# Altium schematic sheet PWR.SchDoc: {Наименование}
size 420 x 297 mm; DocumentNumber: ПЛАС.ХХХХХХ.ХХХ ХХ; SheetNumber: {}; SheetTotal: {}; PageSetup: Record=PageOptions|CenterHorizontal=False|CenterVertical=False|PrintScale=0.95|XCorrection=0.00|YCorrection=0.00|PrintKind=1|BorderSize=5000000|LeftOffset=0|BottomOffset=0|Orientation=1|PaperLength=1000|PaperWidth=1000|Scale=100|PaperSource=15|PrintQuality=600|MediaType=1|DitherType=10|PaperKind=A4|PrintScaleMode=1; Rule: PcbType=ProtelPcb
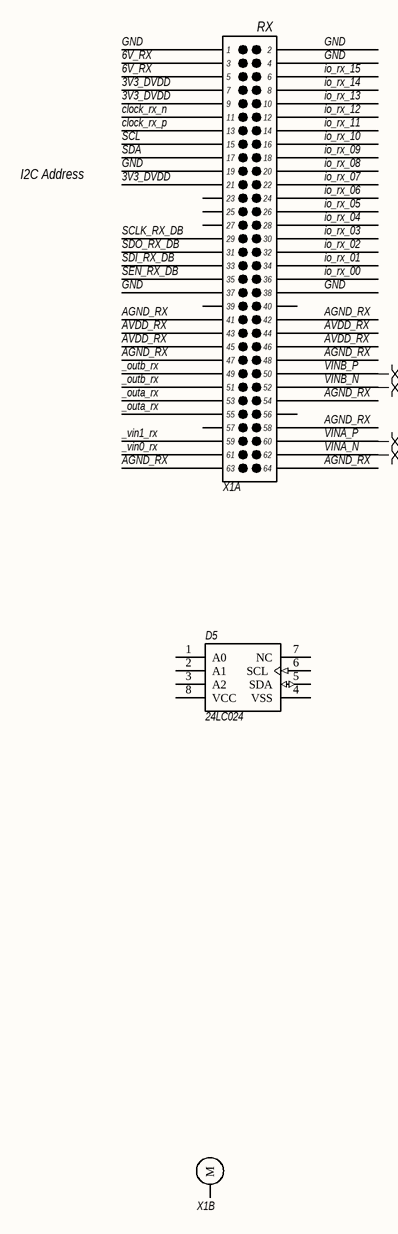
[diagram p0: PWR.SchDoc]

## Parts
D5  24LC024  [SOIC_SN8]
X1  DBoard  [DBoard]  (value not drawn)  (parts A,B of 2)

## Nets
3V3_DVDD: X1.71(7) X1.73(9) X1.85(21)
6V_RX: X1.67(3) X1.69(5)
_outa_rx: X1.117(53) X1.119(55)
_outb_rx: X1.113(49) X1.115(51)
_vin0_rx: X1.125(61)
_vin1_rx: X1.123(59)
AGND_RX: X1.105(41) X1.106(42) X1.111(47) X1.112(48) X1.118(54) X1.122(58) X1.127(63) X1.128(64)
AVDD_RX: X1.107(43) X1.108(44) X1.109(45) X1.110(46)
clock_rx_n: X1.75(11)
clock_rx_p: X1.77(13)
GND: X1.65(1) X1.66(2) X1.68(4) X1.83(19) X1.101(37) X1.102(38)
io_rx_00: X1.100(36)
io_rx_01: X1.98(34)
io_rx_02: X1.96(32)
io_rx_03: X1.94(30)
io_rx_04: X1.92(28)
io_rx_05: X1.90(26)
io_rx_06: X1.88(24)
io_rx_07: X1.86(22)
io_rx_08: X1.84(20)
io_rx_09: X1.82(18)
io_rx_10: X1.80(16)
io_rx_11: X1.78(14)
io_rx_12: X1.76(12)
io_rx_13: X1.74(10)
io_rx_14: X1.72(8)
io_rx_15: X1.70(6)
SCL: X1.79(15)
SCLK_RX_DB: X1.93(29)
SDA: X1.81(17)
SDI_RX_DB: X1.97(33)
SDO_RX_DB: X1.95(31)
SEN_RX_DB: X1.99(35)
VINA_N: X1.126(62)
VINA_P: X1.124(60)
VINB_N: X1.116(52)
VINB_P: X1.114(50)

Not connected (* = marked no-connect by the designer): D5 1(A0) 2(A1) 3(A2) 4(VSS) 5(SDA) 6(SCL) 7(NC) 8(VCC); X1 0(M) 87(23) 89(25) 91(27) 103(39) 104(40) 120(56) 121(57)

## Layout directives
differential pair: VINA_N, VINA_P, VINB_N, VINB_P

## Notes on the sheet
- I2C Address
- Подп. и дата
- Инв. № дубл.
- Взам. инв. №
- Инв. № подл.
- Лист
- Изм.
- № докум.
- Подп.
- Дата
- Копировал
- Формат А3
- (in symbol DBoard, part A) RX

## Library data of the parts
D5 = 24LC024: I2C EEPROM; Manufacturer: Microchip; Capacity: 2kbit; Max Clock: 400 kHz; Voltage: 2.5-5.5V; Name: 24LC024; Package: SOIC-8; Type: I2C EEPROM
X1 = DBoard: USRP DBoard; Manufacturer: Molex; Name: 1.00mm Pitch Mezzanine 714390164; P/N: 714390164; Supplier 1: Digi-Key; Supplier Part Number 1: WM17201-ND